# EAGLE design Apo Board 2017_PB_MILLABLE (EAGLE 7.7.0)
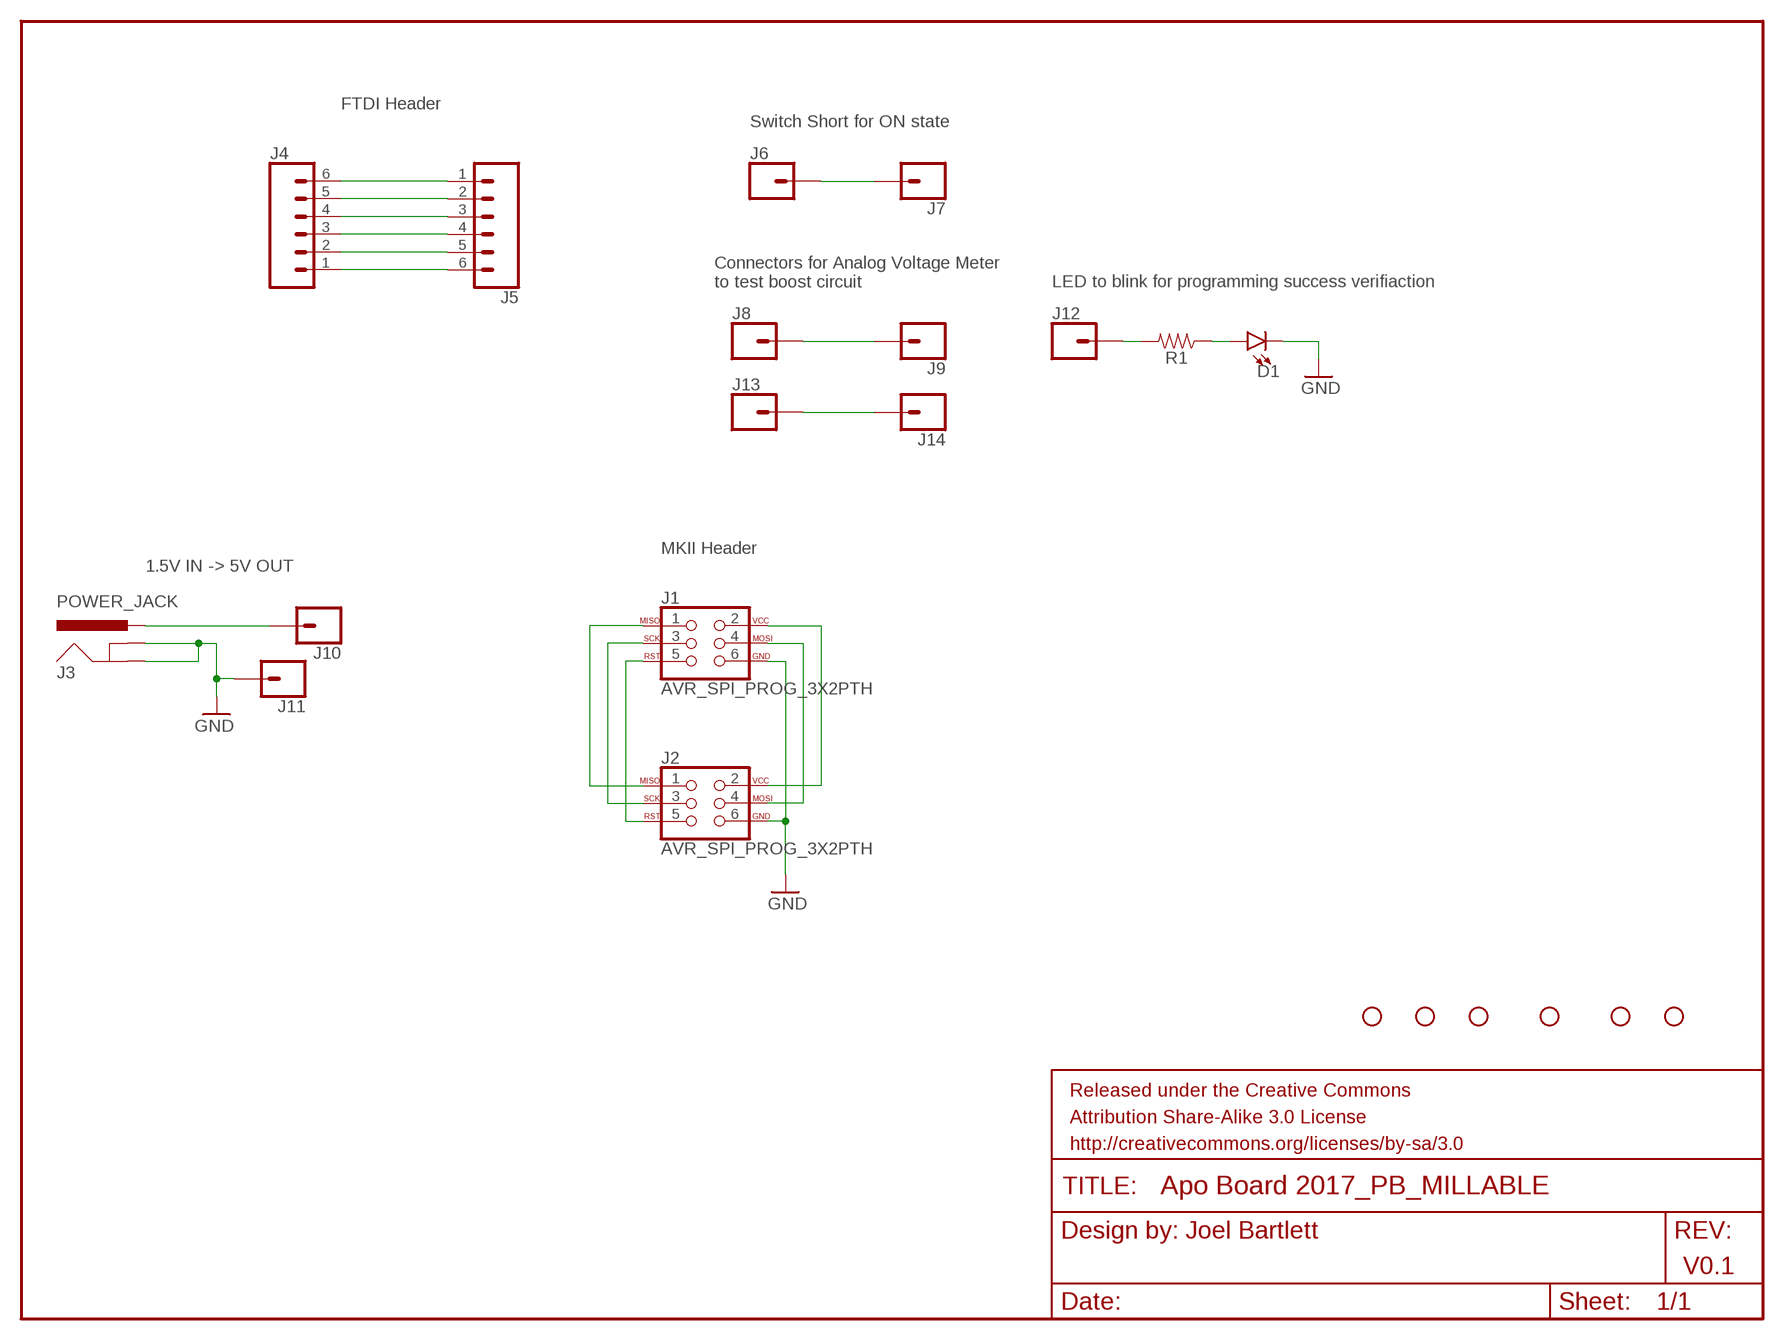
[diagram p0: schematic, sheet 1]

## Parts
D1  LED5MM  [LED_5MM]
FRAME1  FRAME-LETTER  [CREATIVE_COMMONS]
H1  STAND-OFF  [STAND-OFF]
H2  STAND-OFF  [STAND-OFF]
H3  STAND-OFF  [STAND-OFF]
H4  STAND-OFF  [STAND-OFF]
H5  STAND-OFF  [STAND-OFF]
H6  STAND-OFF  [STAND-OFF]
J1  AVR_SPI_PROG_3X2PTH  [2X3]
J2  AVR_SPI_PROG_3X2PTH  [2X3]
J3  POWER_JACK  [POWER_JACK_PTH]
J4  CONN_06LONGPADS  [1X06_LONGPADS]
J5  CONN_06LONGPADS  [1X06_LONGPADS]
J6  CONN_01PTH_LONGPAD  [1X01_LONGPAD]
J7  CONN_01PTH_LONGPAD  [1X01_LONGPAD]
J8  CONN_01PTH_LONGPAD  [1X01_LONGPAD]
J9  CONN_01PTH_LONGPAD  [1X01_LONGPAD]
J10  CONN_01PTH_LONGPAD  [1X01_LONGPAD]
J11  CONN_01PTH_LONGPAD  [1X01_LONGPAD]
J12  CONN_01PTH_LONGPAD  [1X01_LONGPAD]
J13  CONN_01PTH_LONGPAD  [1X01_LONGPAD]
J14  CONN_01PTH_LONGPAD  [1X01_LONGPAD]
R1  RESISTORAXIAL-0.3-KIT  [AXIAL-0.3-KIT]

## Nets
GND: D1.K(C) J1.6 J2.6 J3.GND J3.GNDBREAK J11.1
N$1: J3.PWR J10.1
N$2: J1.4 J2.4
N$3: J1.2 J2.2
N$4: J1.5 J2.5
N$5: J1.3 J2.3
N$6: J1.1 J2.1
N$7: J4.6 J5.1
N$8: J4.5 J5.2
N$9: J4.4 J5.3
N$10: J4.3 J5.4
N$11: J4.2 J5.5
N$12: J4.1 J5.6
N$13: J6.1 J7.1
N$14: D1.A R1.P$1
N$15: J12.1 R1.P$2
N$16: J8.1 J9.1
N$17: J13.1 J14.1

## Notes on the sheet
- FTDI Header
- Switch Short for ON state
- Connectors for Analog Voltage Meter
  to test boost circuit
- LED to blink for programming success verifiaction
- MKII Header
- 1.5V IN -> 5V OUT
- Joel Bartlett
- V0.1

## Library data of the parts
D1 = SparkFun-LED:LED: LED (Generic) Standard schematic elements and footprints for 5mm, 3mm, 1206, and 0603 sized LEDs. Generic LEDs with no color specified.
FRAME1 = SparkFun-Aesthetics:FRAME-LETTER: Schematic Frame Standard 8.5x11 US Letter frame
H1-H6 = SparkFun-Hardware:STAND-OFF: Stand Off Drill holes for mechanically mounting via screws, standoffs, etc. Note: Use the keepout ring to avoid running the screw head into surrounding components. Variant Overviews STAND-OFF - Mechanical footprint for a #4 phillips button head screw. STAND-OFF-TIGHT - Mechanical footprint for a #4 phillips button head screw, Example SparkFun Products Screw - Phillips Head (1/4", 4-40, 10 pack) <https://www.sparkfun.com/products/10453> (PRT-10453) Screw - Phillips Head (1/2", 4-40, 10 pack) <https://www.sparkfun.com/products/10452> (PRT-10452) Screw - Phillips Head (3/4", 4-40, 10 pack) <https://www.sparkfun.com/products/10451> (PRT-10451) Screw - Phillips Head (1", 4-40, 10 pack) <https://www.sparkfun.com/products/10450> (PRT-10450)
J1 J2 = SparkFun-Connectors:AVR_SPI_PROG_3X2: AVR ISP 6 Pin This is the reduced ISP connector for AVR programming. Common on Arduino. This footprint will take up less PCB space and can be used with a 10-pin to 6-pin adapter such as SKU: BOB-08508 **Special note about "TEST_POINT" package. The stop mask is on the top side, so if you want your programming test points to be on the bottom of your board, make sure to place this package on the bottom side of the board. This also ensure that the orientation to program from the bottom side will be correct. SparkFun Products: SparkFun ISP Pogo Adapter <https://www.sparkfun.com/products/11591> - NS Tiny AVR Programmer <https://www.sparkfun.com/products/11801> -PTH
J3 = SparkFun-Connectors:POWER_JACK: Power Jack Connector This is the standard 5.5mm barrel jack for power. The PTH is the most common, proven, reliable, footprint. The Slot footprint only works if the mill layer is transmitted to the PCB fab house so be warned. Here are the connectors we sell at SparkFun: DC Barrel Power Jack/Connector <https://www.sparkfun.com/products/119> (PRT-00119) DC Barrel Power Jack/Connector (SMD) <https://www.sparkfun.com/products/12748> (PRT-12748) DC Barrel Jack Adapter - Breadboard Compatible <https://www.sparkfun.com/products/10811> (PRT-10811) It is used on this SparkFun product (and many, many others): SparkFun RedBoard - Programmed with Arduino <https://www.sparkfun.com/products/12757> (DEV-12757) Also, if you need a mating power supply or connector, please check these out: Wall Adapter Power Supply - 9VDC 650mA <https://www.sparkfun.com/products/298> (TOL-00298) DC Barrel Jack Adapter - Male <https://www.sparkfun.com/products/10287> (PRT-10287); PROD_ID: CONN-08197
J4 J5 = SparkFun-Connectors:CONN_06: Multi connection point. Often used as Generic Header-pin footprint for 0.1 inch spaced/style header connections On any of the 0.1 inch spaced packages, you can populate with these: Break Away Headers - Straight <https://www.sparkfun.com/products/116> (PRT-00116) Break Away Male Headers - Right Angle <https://www.sparkfun.com/products/553> (PRT-00553) Female Headers <https://www.sparkfun.com/products/115> (PRT-00115) Break Away Headers - Machine Pin <https://www.sparkfun.com/products/117> (PRT-00117) Break Away Female Headers - Swiss Machine Pin <https://www.sparkfun.com/products/743> (PRT-00743) Arduino Stackable Header - 6 Pin <https://www.sparkfun.com/products/9280> (PRT-09280) For SCREWTERMINALS and SPRING TERMINALS visit here: Screw Terimnals on SparkFun.com <https://www.sparkfun.com/search/results?term=Screw+Terminals> (5mm/3.5mm/2.54mm spacing) This device is also useful as a general connection point to wire up your design to another part of your project. Our various solder wires solder well into these plated through hole pads. Hook-Up Wire - Assortment (Stranded, 22 AWG) <https://www.sparkfun.com/products/11375> (PRT-11375) Hook-Up Wire - Assortment (Solid Core, 22 AWG) <https://www.sparkfun.com/products/11367> (PRT-11367) View the entire wire category on our website here <https://www.sparkfun.com/categories/141>
J6-J14 = SparkFun-Connectors:CONN_01: Single connection point. Often used as Generic Header-pin footprint for 0.1 inch spaced/style header connections On any of the 0.1 inch spaced packages, you can populate with these: Break Away Headers - Straight <https://www.sparkfun.com/products/116> (PRT-00116) Break Away Male Headers - Right Angle <https://www.sparkfun.com/products/553> (PRT-00553) Female Headers <https://www.sparkfun.com/products/115> (PRT-00115) Break Away Headers - Machine Pin <https://www.sparkfun.com/products/117> (PRT-00117) Break Away Female Headers - Swiss Machine Pin <https://www.sparkfun.com/products/743> (PRT-00743) This device is also useful as a general connection point to wire up your design to another part of your project. Our various solder wires solder well into these plated through hole pads. Hook-Up Wire - Assortment (Stranded, 22 AWG) <https://www.sparkfun.com/products/11375> (PRT-11375) Hook-Up Wire - Assortment (Solid Core, 22 AWG) <https://www.sparkfun.com/products/11367> (PRT-11367) View the entire wire category on our website here <https://www.sparkfun.com/categories/141> Special notes: SMTSO-256-ET is a "flush mount" nut for a 4-40 screw. We mostly use this on specialty testbeds; it is a nice way to connect hardware to your PCB at an adjustable hieght. Also note, the SNAP packages are for using a snappable style connector. We sell a baggie of snaps and they are also used on two LilyPad designs: Snap Assortment - 30 pack (male and female) <https://www.sparkfun.com/products/11347> (DEV-11347) LilyPad Arduino SimpleSnap <https://www.sparkfun.com/products/10941> (DEV-10941) LilyPad SimpleSnap Protoboard <https://www.sparkfun.com/products/10940> (DEV-10940)
R1 = SparkFun-Resistors:RESISTOR: Generic Resistor Package

## Net classes
0 default: width 0.152 mm, drill 0.305 mm, clearance 0.152 mm
1 vcc: width 0.254 mm
3 ButtonSignal: width 0.254 mm

## Board
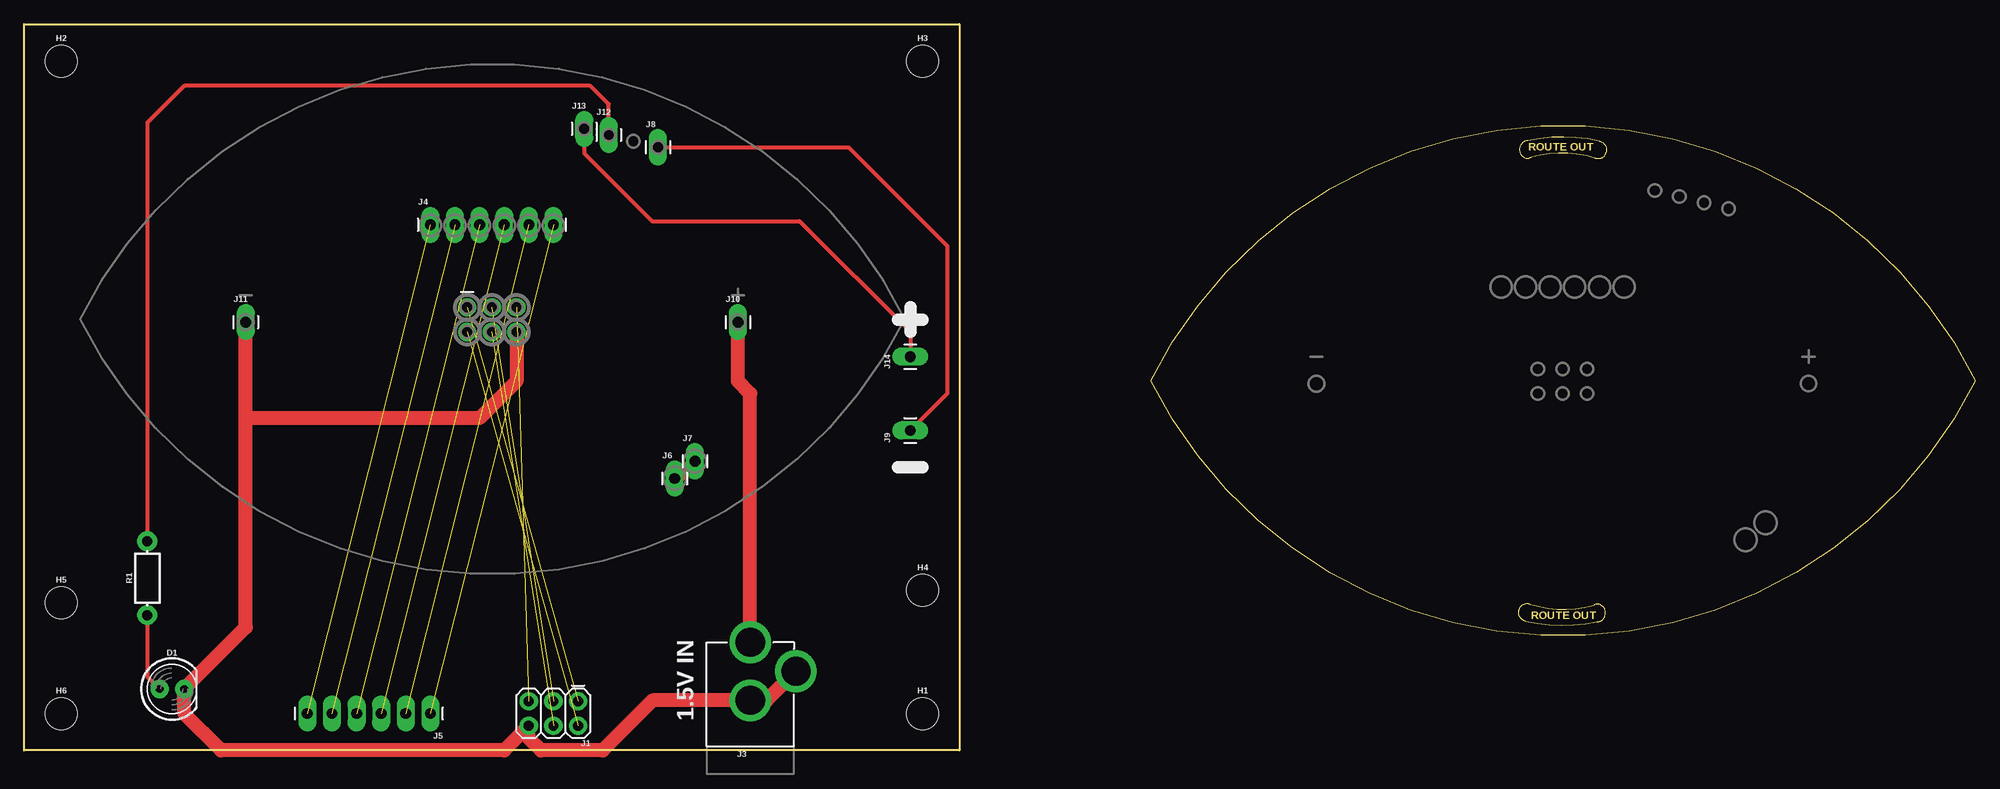
[diagram p1: board, top side]
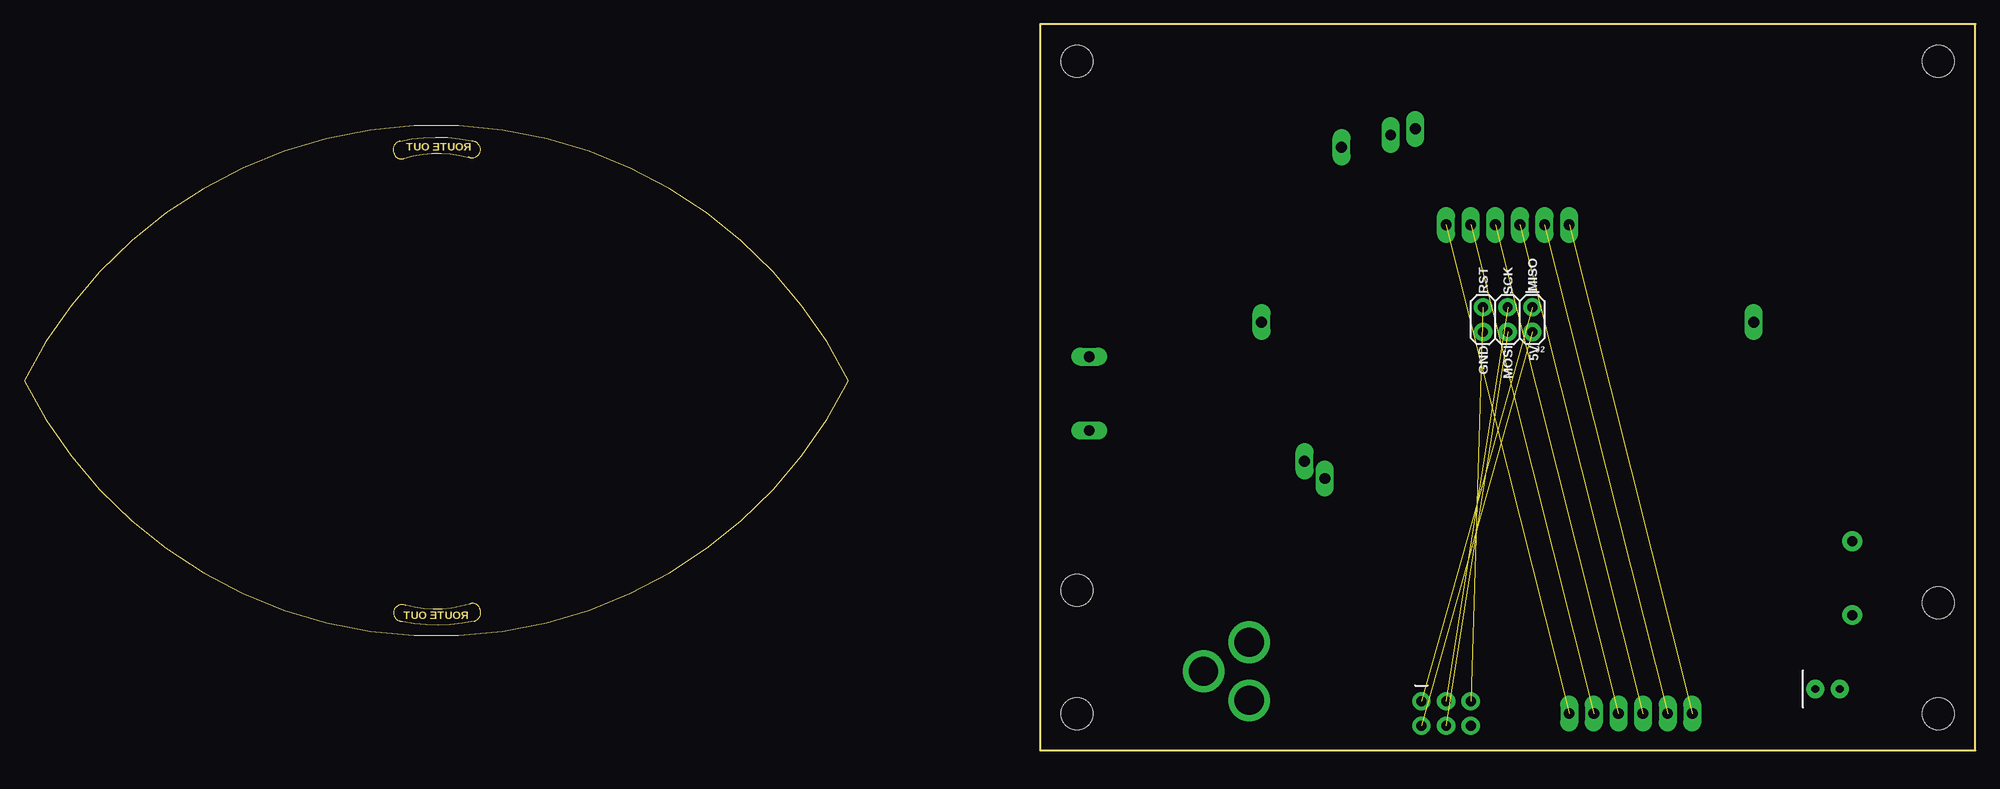
[diagram p2: board, bottom side, seen from below]

Size 201.35 x 74.93 mm. Coordinates in mm from the lower left corner, seen from the top.
Outline: 0,74.93 96.52,74.93 96.52,0 0,0 0,74.93
Outline: 116.26,38.15 arc-127 201.35,38.15 arc-127 116.26,38.15
Outline: 154.94,13.34 arc24 162.31,13.27 arc171 162.37,15.11 arc25 161.99,14.99 arc-33 155.38,15.11 arc93 154.31,14.61 arc103 154.94,13.34
Outline: 162.56,62.87 arc24 155.19,62.93 arc171 155.13,61.09 arc25 155.51,61.21 arc-33 162.12,61.09 arc93 163.19,61.59 arc103 162.56,62.87
Copper layers (1*16): Top 0.035mm / dielectric 1.5mm / Bottom 0.035mm
Design rules "SparkFun-2-layer-TIGHT": minimum track width 7mil, minimum drill 15mil, track to track 7mil, track to pad 7mil, pad to pad 7mil, via to via 7mil, smd to smd 7mil, copper to edge 7mil, drill to drill 7mil, minimum pad ring 7mil, minimum via ring 7mil, stop-mask expansion 4mil, vias tented up to drill 25mil, thermal gap 10mil

### Footprints (pad centres in the part's own frame; a part is rotated, then mirrored left to right if it is on the bottom)
LED_5MM = drill 0.813 pad 1.88: A -1.27,0; K 1.27,0
STAND-OFF = hole 3.302: 0,0
2X3 = drill 1.016 pad 1.88: 1 0,0; 2 0,2.54; 3 2.54,0; 4 2.54,2.54; 5 5.08,0; 6 5.08,2.54
POWER_JACK_PTH = drill 2.997 pad 4.318: GND 0,7.7; GNDBREAK 4.7,10.7; PWR 0,13.7
1X06_LONGPADS = drill 1.118 pad 1.88 long: 1 0,0; 2 2.54,0; 3 5.08,0; 4 7.62,0; 5 10.16,0; 6 12.7,0
1X01_LONGPAD = drill 1.118 pad 1.88 long: 1 0,0
AXIAL-0.3-KIT = drill 1.016 pad 2.032: P$1 -3.81,0; P$2 3.81,0

### Placement (x,y rotation side)
D1  15.24,6.35 0 top
FRAME1  26.44,4.75 0 top
H1  92.71,3.81 0 top
H2  3.81,71.12 0 top
H3  92.71,71.12 0 top
H4  92.71,16.51 0 top
H5  3.81,15.24 0 top
H6  3.81,3.81 0 top
J1  57.15,5.08 180 top
J2  45.72,45.72 180 bottom
J3  74.93,-2.54 0 top
J4  41.91,54.23 0 top
J5  41.91,3.81 180 top
J6  67.12,28.07 0 top
J7  69.22,29.85 0 top
J8  65.41,62.23 0 top
J9  91.44,33.02 90 top
J10  73.66,44.2 0 top
J11  22.86,44.2 0 top
J12  60.32,63.5 0 top
J13  57.78,64.14 0 top
J14  91.44,40.64 90 top
R1  12.7,17.78 90 top

### Tracks (layer width: path | path; a pad name or v marks a point on that pad's centre or on a via)
GND
  Top 1.422: J3.GNDBREAK 76.63,5.16 J3.GND 64.85,5.16 59.69,0 53.34,0 52.07,1.27 J1.6 49.53,0 20.32,0 16.51,3.81 D1.K 22.86,12.7 22.86,34.29 | 22.86,34.29 J11.1 | J2.6 50.8,38.1 46.99,34.29 22.86,34.29
N$1
  Top 1.422: J3.PWR 74.93,36.83 73.66,38.1 J10.1
N$2  (1 unrouted)
N$3  (1 unrouted)
N$4  (1 unrouted)
N$5  (1 unrouted)
N$6  (1 unrouted)
N$7  (1 unrouted)
N$8  (1 unrouted)
N$9  (1 unrouted)
N$10  (1 unrouted)
N$11  (1 unrouted)
N$12  (1 unrouted)
N$13
  Top 1.27: J6.1 67.44,28.07 J7.1
N$14
  Top 0.406: R1.P$1 12.7,7.62 D1.A
N$15
  Top 0.406: J12.1 60.32,66.68 58.42,68.58 16.51,68.58 12.7,64.77 R1.P$2
N$16
  Top 0.406: J8.1 85.09,62.23 95.25,52.07 95.25,36.83 J9.1
N$17
  Top 0.406: J13.1 57.78,61.59 64.77,54.61 80.01,54.61 91.44,43.18 J14.1

### Text on the board
Dimension: ROUTE OUT | ROUTE OUT
tPlace: 1.5V IN
bPlace: MISO | SCK | RST | 5V | MOSI | GND
tValues: Joel Bartlett
tDocu: 5V | SCL | SDA | GND | A5 | A4 | 5V | GND | GND | SCL | TX | RX | 5V | SDA | DTR | GND | A5 | A4 | TX | RX | 5V | GND | GND | MISO | SCK | RST | DTR | MISO | SCK | RST | 5V | MOSI | GND | 5V | MOSI | GND